# Altium project SmartHome.PrjPCB
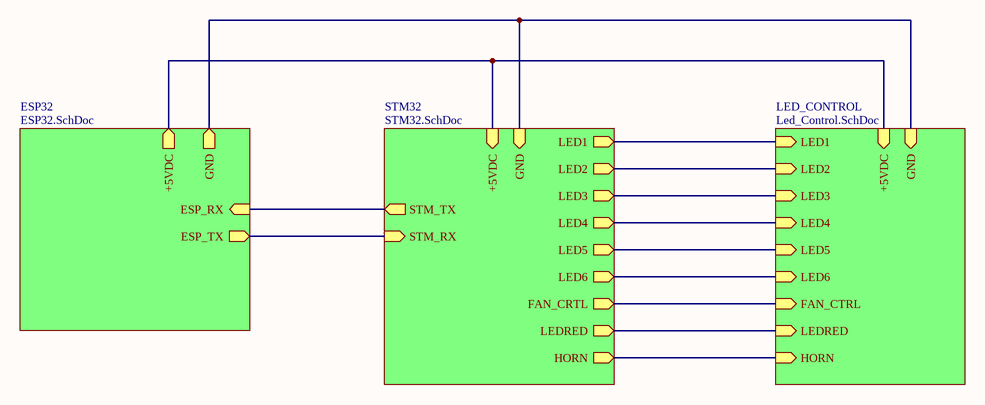
[diagram p0: Diagram.SchDoc]
4 sheets, 77 parts. Net scope: hierarchical (ports join the sheet entries above them; power ports are global).
Board file: SmartHome.PcbDoc
Sheets:
  Diagram.SchDoc
    STM32 = STM32.SchDoc
    ESP32 = ESP32.SchDoc
    LED_CONTROL = Led_Control.SchDoc

## Sheet Diagram.SchDoc
size A

### Sub-sheets
ESP32 = ESP32.SchDoc: ESP_RX (in), ESP_TX (out), GND (out), +5VDC (out)
LED_CONTROL = Led_Control.SchDoc: LED1 (in), LED2 (in), LED3 (in), LED4 (in), LED5 (in), LED6 (in), FAN_CTRL (in), LEDRED (in), HORN (in), GND (in), +5VDC (in)
STM32 = STM32.SchDoc: LED1 (out), LED2 (out), LED3 (out), LED4 (out), LED5 (out), LED6 (out), FAN_CRTL (out), LEDRED (out), HORN (out), STM_TX (out), STM_RX (in), +5VDC (in), GND (in)

### Nets
+5VDC: sheet STM32/+5VDC, sheet ESP32/+5VDC, sheet LED_CONTROL/+5VDC
GND: sheet STM32/GND, sheet ESP32/GND, sheet LED_CONTROL/GND
FAN_CTRL: sheet STM32/FAN_CRTL, sheet LED_CONTROL/FAN_CTRL
HORN: sheet STM32/HORN, sheet LED_CONTROL/HORN
LED1: sheet STM32/LED1, sheet LED_CONTROL/LED1
LED2: sheet STM32/LED2, sheet LED_CONTROL/LED2
LED3: sheet STM32/LED3, sheet LED_CONTROL/LED3
LED4: sheet STM32/LED4, sheet LED_CONTROL/LED4
LED5: sheet STM32/LED5, sheet LED_CONTROL/LED5
LED6: sheet STM32/LED6, sheet LED_CONTROL/LED6
LEDRED: sheet STM32/LEDRED, sheet LED_CONTROL/LEDRED
UART1_RX: sheet STM32/STM_RX, sheet ESP32/ESP_TX
UART1_TX: sheet STM32/STM_TX, sheet ESP32/ESP_RX

## Sheet STM32.SchDoc
size A3
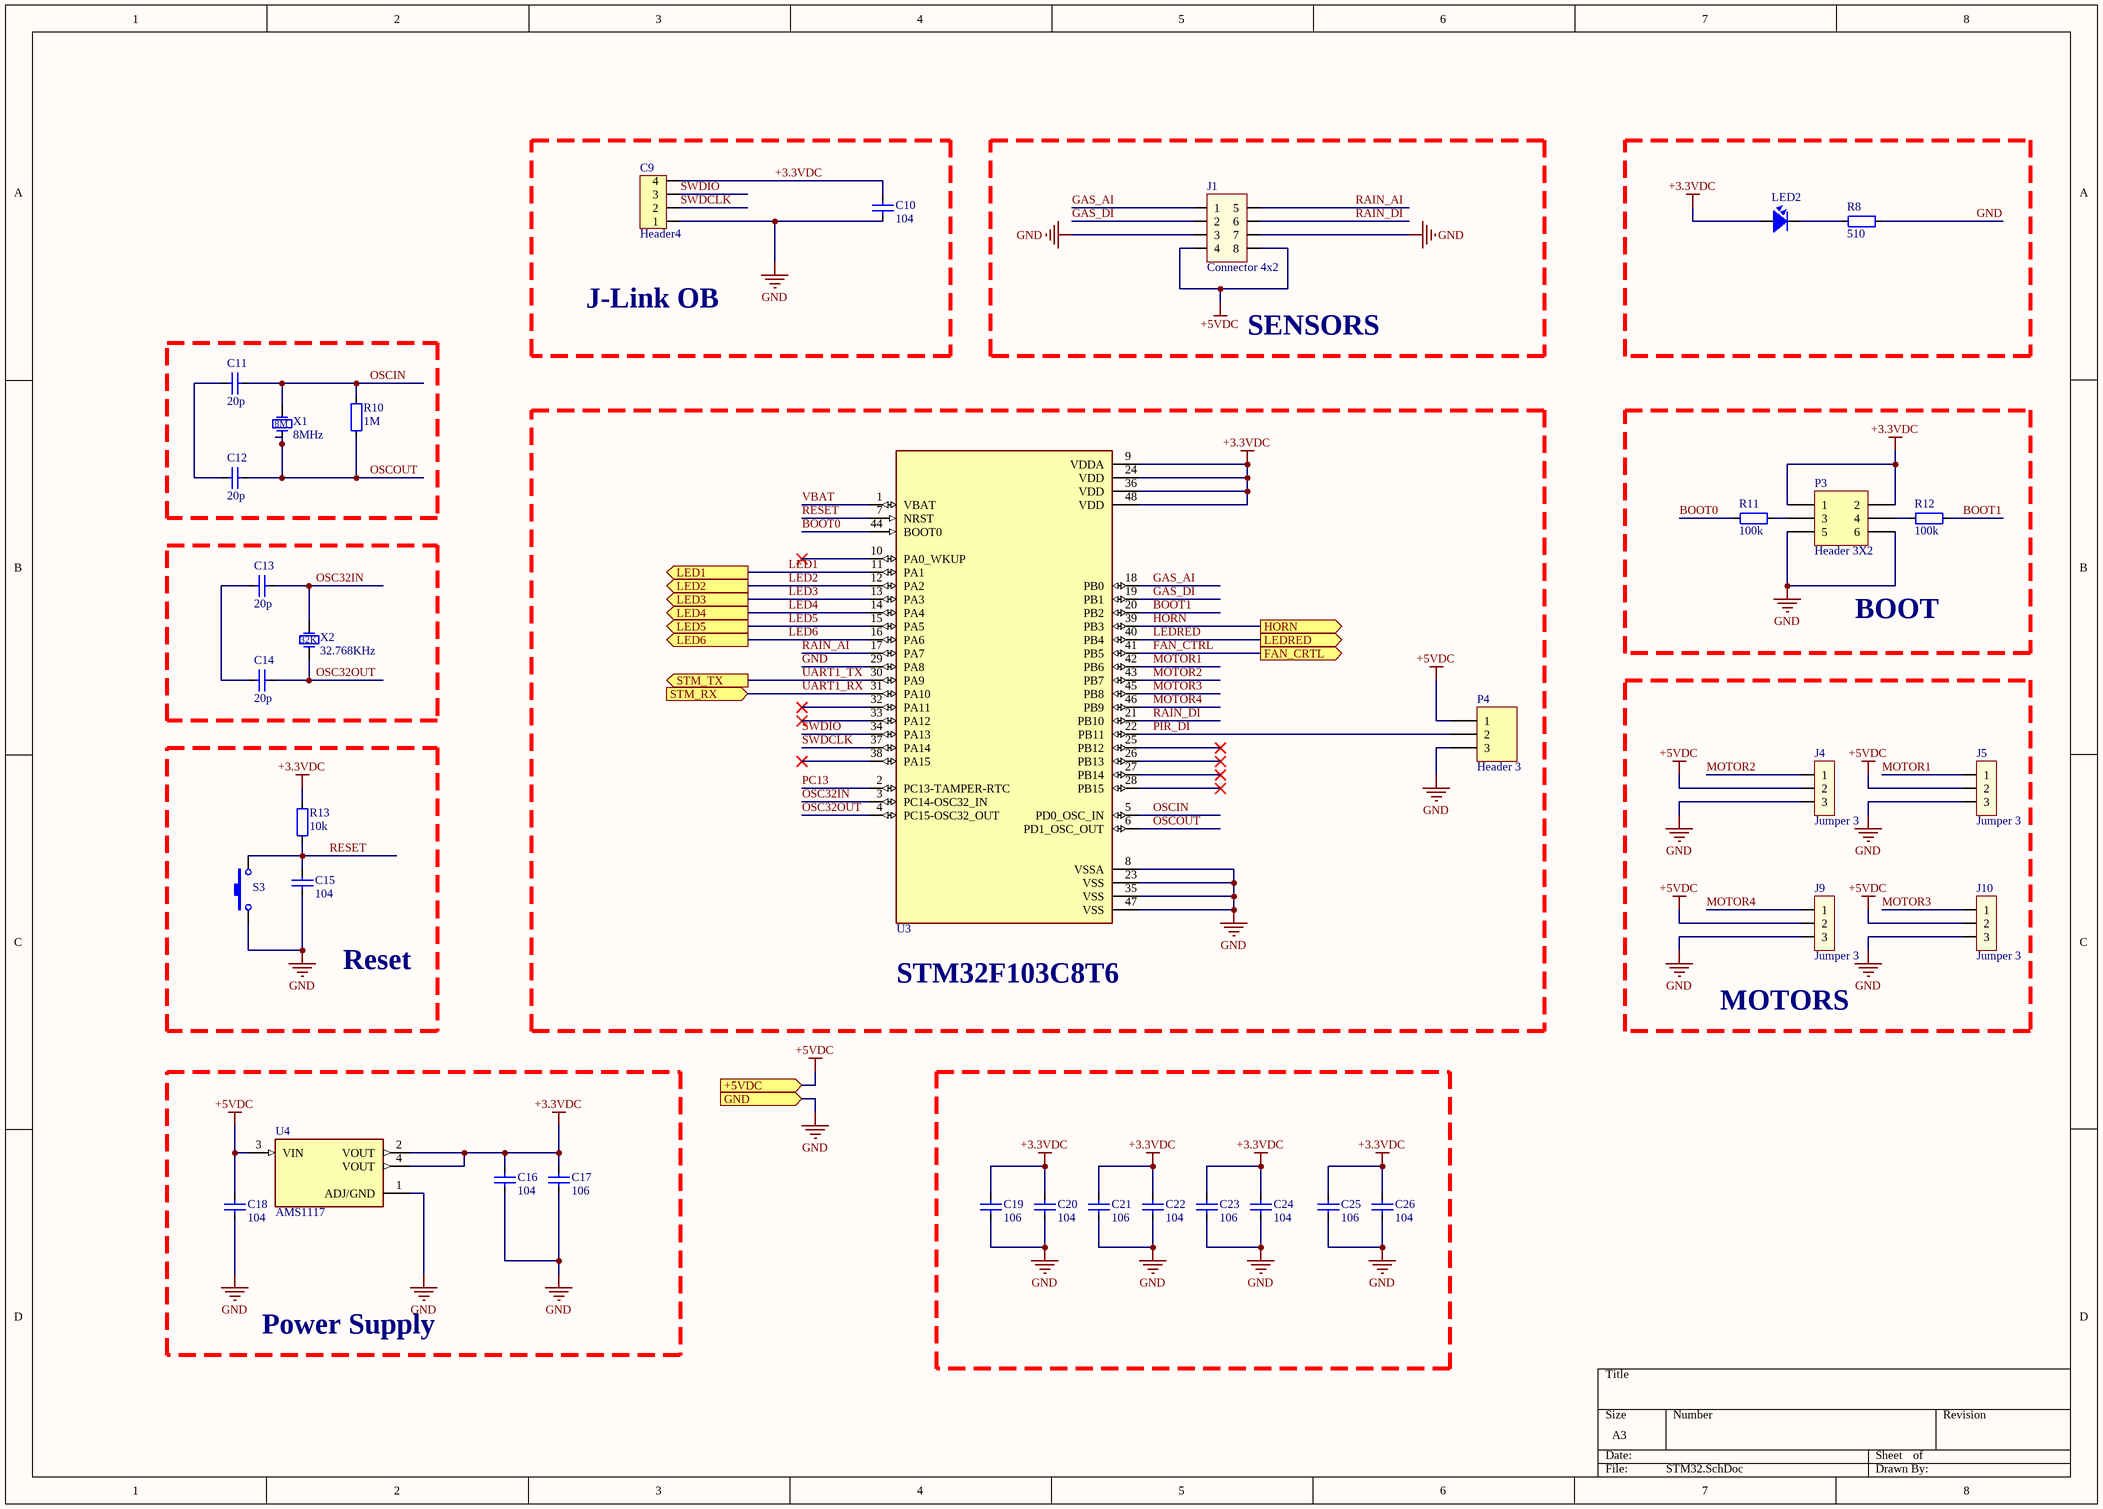
[diagram p1: STM32.SchDoc]

### Parts
C9  Header4  [Header4]
C10  104  [CAP_0805]
C11  20p  [CAP_0805]
C12  20p  [CAP_0805]
C13  20p  [CAP_0805]
C14  20p  [CAP_0805]
C15  104  [CAP_0805]
C16  104  [CAP_0805]
C17  106  [CAP_0805]
C18  104  [CAP_0805]
C19  106  [CAP_0805]
C20  104  [CAP_0805]
C21  106  [CAP_0805]
C22  104  [CAP_0805]
C23  106  [CAP_0805]
C24  104  [CAP_0805]
C25  106  [CAP_0805]
C26  104  [CAP_0805]
J1  Connector 4x2  [JP4x2]
J4  Jumper 3  [JP3]
J5  Jumper 3  [JP3]
J9  Jumper 3  [JP3]
J10  Jumper 3  [JP3]
LED2  LED  [LED-0805-Red]  (value not drawn)
P3  Header 3X2  [HDR2X3]
P4  Header 3  [HDR1X3]
R8  510  [RES-SMD-0805]
R10  1M  [RES-SMD-0805]
R11  100k  [RES-SMD-0805]
R12  100k  [RES-SMD-0805]
R13  10k  [RES-SMD-0805]
S3  SW-SMD  [SW-SMD]  (value not drawn)
U3  STM32  [LQFP 48]  (value not drawn)
U4  AMS1117  [SOT229P700X180-4N]
X1  8MHz  [CRYSTAL_ABM3 5x3.2mm]
X2  32.768KHz  [Crystal_ABS07_SMD-3.2x1.5MM]

### Blocks framed on the sheet
J-Link OB: C9 C10
SENSORS: J1
STM32F103C8T6: P4 U3
BOOT: P3 R11 R12
MOTORS: J4 J5 J9 J10
Reset: C15 R13 S3
Power Supply: C16-C18 U4

### Ports
+5VDC (in), FAN_CRTL (out), GND (in), HORN (out), LED1 (out), LED2 (out), LED3 (out), LED4 (out), LED5 (out), LED6 (out), LEDRED (out), STM_RX (in), STM_TX (out)

### Nets
+3.3VDC: C9.4 C10.2 C16.2 C17.2 C19.2 C20.2 C21.2 C22.2 C23.2 C24.2 C25.2 C26.2 LED2.1 P3.1 P3.2 R13.2 U3.9(VDDA) U3.24(VDD) U3.36(VDD) U3.48(VDD) U4.2(VOUT) U4.4(VOUT)
+5VDC: C18.2 J1.4 J1.8 J4.2 J5.2 J9.2 J10.2 P4.1 U4.3(VIN) ; port +5VDC
GND: C9.1 C10.1 C15.1 C16.1 C17.1 C18.1 C19.1 C20.1 C21.1 C22.1 C23.1 C24.1 C25.1 C26.1 J1.3 J1.7 J4.3 J5.3 J9.3 J10.3 P3.5 P3.6 P4.3 R8.1 S3.1 U3.8(VSSA) U3.23(VSS) U3.29(PA8) U3.35(VSS) U3.47(VSS) U4.1(ADJ/GND) ; port GND
BOOT0: R11.2 U3.44(BOOT0)
BOOT1: R12.1 U3.20(PB2)
FAN_CTRL: U3.41(PB5) ; port FAN_CRTL
GAS_AI: J1.1 U3.18(PB0)
GAS_DI: J1.2 U3.19(PB1)
HORN: U3.39(PB3) ; port HORN
LED1: U3.11(PA1) ; port LED1
LED2: U3.12(PA2) ; port LED2
LED3: U3.13(PA3) ; port LED3
LED4: U3.14(PA4) ; port LED4
LED5: U3.15(PA5) ; port LED5
LED6: U3.16(PA6) ; port LED6
LEDRED: U3.40(PB4) ; port LEDRED
MOTOR1: J5.1 U3.42(PB6)
MOTOR2: J4.1 U3.43(PB7)
MOTOR3: J10.1 U3.45(PB8)
MOTOR4: J9.1 U3.46(PB9)
OSC32IN: C13.1 U3.3(PC14-OSC32_IN) X2.1(OSC1)
OSC32OUT: C14.1 U3.4(PC15-OSC32_OUT) X2.2(OSC2)
OSCIN: C11.1 R10.2 U3.5(PD0_OSC_IN) X1.1(OSC1)
OSCOUT: C12.1 R10.1 U3.6(PD1_OSC_OUT) X1.2(OSC2)
PC13: U3.2(PC13-TAMPER-RTC)
PIR_DI: P4.2 U3.22(PB11)
RAIN_AI: J1.5 U3.17(PA7)
RAIN_DI: J1.6 U3.21(PB10)
RESET: C15.2 R13.1 S3.2 U3.7(NRST)
SWDCLK: C9.2 U3.37(PA14)
SWDIO: C9.3 U3.34(PA13)
UART1_RX: U3.31(PA10) ; port STM_RX
UART1_TX: U3.30(PA9) ; port STM_TX
VBAT: U3.1(VBAT)
NetC11_2: C11.2 C12.2
NetC13_2: C13.2 C14.2
NetLED2_2: LED2.2 R8.2
NetP3_3: P3.3 R11.1
NetP3_4: P3.4 R12.2

Not connected (* = marked no-connect by the designer): U3 10(PA0_WKUP)* 25(PB12)* 26(PB13)* 27(PB14)* 28(PB15)* 32(PA11)* 33(PA12)* 38(PA15)*

### Notes on the sheet
- (in symbol ABM3-8.000MHZ-D2Y-T) 8M
- (in symbol ABS07-32.768KHZ-T) 32K

### Library data of the parts
C9 = Header4: Header IDC, 4 x 1 Pin Vertical 2.54mm Pitch (Non-Boxed, Male); Manufacturer: W¨¹rth Elektronik eiSos GmbH; partNo: 613002143121; ComponentLink1 Description: Manufacturer; ComponentLink2 Description: Datasheet; NoPins: 02; Created Date: 29 March 2013; ComponentLink1URL: http://www.we-online.com; ComponentLink2URL: http://katalog.we-online.de/em/datasheet/6130xx143121.pdf; Created by: Karrer Zheng
C10-C26 = CapSMD: Capacitor; Value: 33p; Published: 8-Jun-2000; LatestRevisionDate: 17-Jul-2002; LatestRevisionNote: Re-released for DXP Platform.; PackageReference: RAD-0.3; Publisher: Altium Limited
J1 = JP4x2: Value: Connector 4x2
J4 J5 J9 J10 = JP3: Value: J3
LED2 = LED: LED Single colour Green and Red; Value: LED 3 ly Single Colour
P3 = Header 3X2: Header, 3-Pin, Dual row; LatestRevisionDate: 17-Jul-2002; LatestRevisionNote: Re-released for DXP Platform.; Publisher: Altium Limited
P4 = Header 3: Header, 3-Pin; LatestRevisionDate: 17-Jul-2002; LatestRevisionNote: Re-released for DXP Platform.; Publisher: Altium Limited
R8 R10-R13 = Resistor - SMD: Resistor; Manufacturer: Generic Components; Class: Passive; Published: 08/06/2000; Publisher: Altium Hobart Technology Centre
S3 = SW-SMD: Switch; Published: 24-Mar-1999; LatestRevisionDate: 17-Jul-2002; LatestRevisionNote: Re-released for DXP Platform.; PackageReference: SPST-2; Publisher: Altium Limited
U3 = STM32F103C8T6: STM32 ARM-based 32-bit MCU with 64 Kbytes Flash, 64-pin LQFP, Industrial Temperature
U4 = AMS1117: 1A LOW DROPOUT VOLTAGE REGULATOR SOT-223; MF: Advanced Monolithic Systems; Price: None; Availability: Not in stock; Package: SOT-223 Seeed Technology; MP: AMS1117; Value: *; SnapEDA_Link: https://www.snapeda.com/parts/AMS1117/Advanced+Monolithic+Systems/view-part/?ref=snap; Check_prices: https://www.snapeda.com/parts/AMS1117/Advanced+Monolithic+Systems/view-part/?ref=eda
X1 = ABM3-8.000MHZ-D2Y-T: CRYSTAL 8.0000MHZ 18pF SMD; Solder: SMT; CompanyID: VT-00517; Value: 8MHz; MPN: ABM3-8.000MHZ-D2Y-T; Category: CRYSTAL
X2 = ABS07-32.768KHZ-T: CRYSTAL 32.7680KHZ 12.5pF SMD; Solder: SMT; CompanyID: VT-01153; MPN: ABS07-32.768KHZ-T; Value: 32.768KHz; Category: CRYSTAL

## Sheet ESP32.SchDoc
size A4
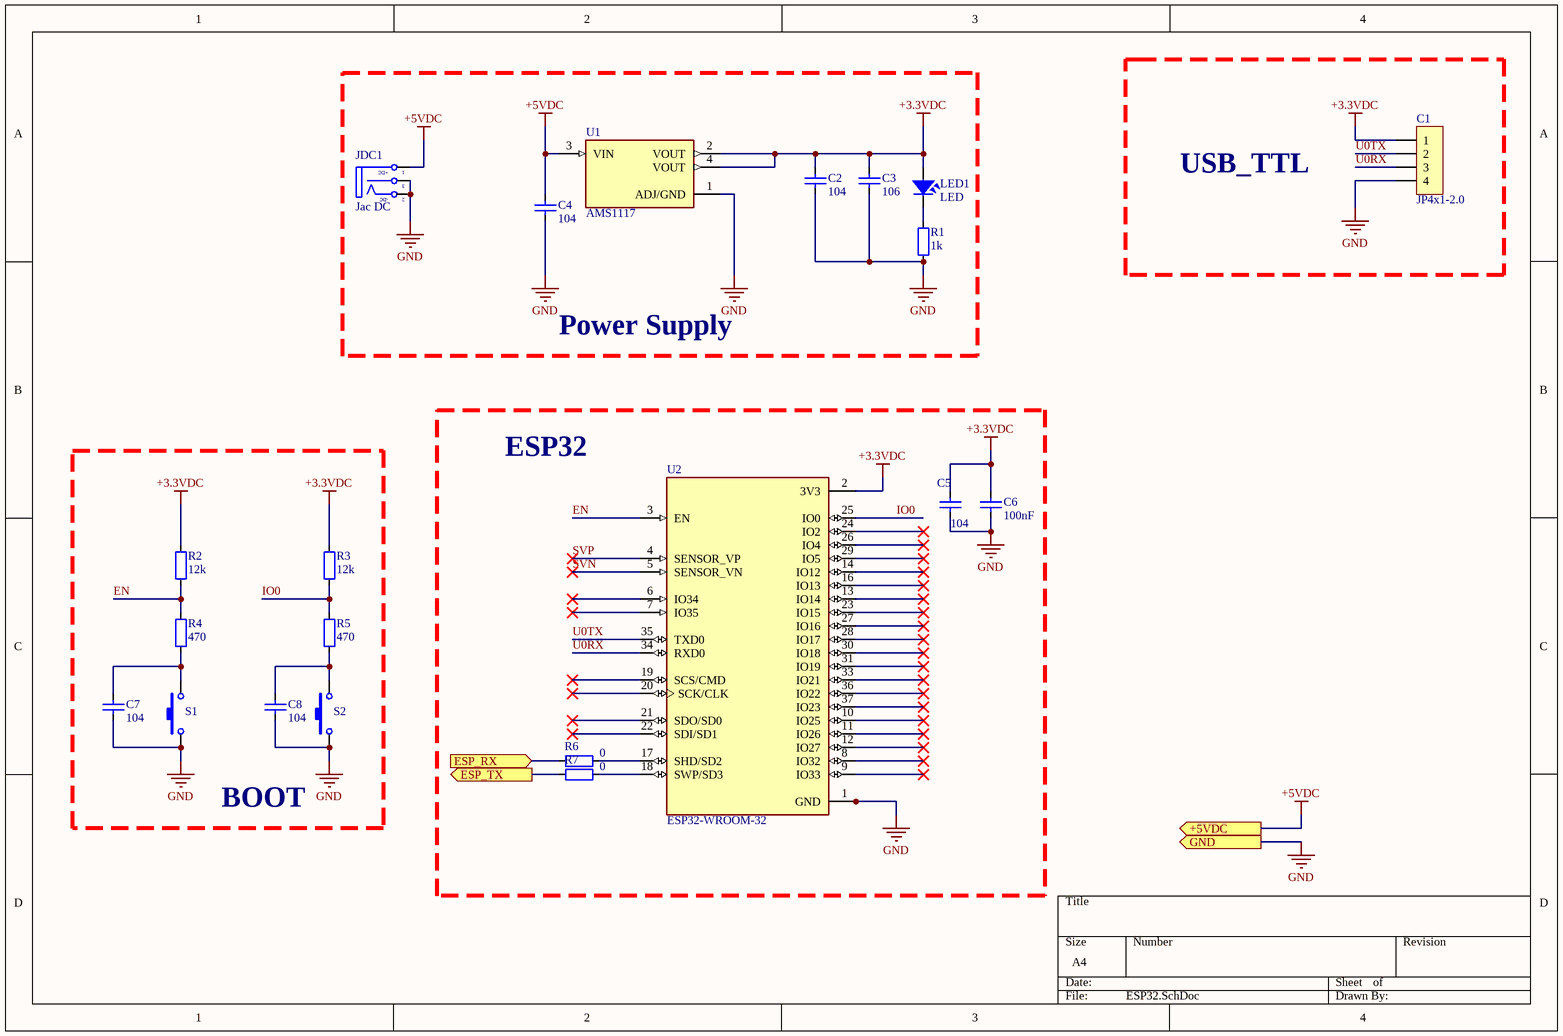
[diagram p2: ESP32.SchDoc]

### Parts
C1  JP4x1-2.0  [J4-D1T]
C2  104  [CAP_0805]
C3  106  [CAP_0805]
C4  104  [CAP_0805]
C5  104  [CAP_0805]
C6  100nF  [CAP_0805]
C7  104  [CAP_0805]
C8  104  [CAP_0805]
JDC1  Jac DC  [DC-IN]
LED1  LED  [LED-0805-Red]
R1  1k  [RES-SMD-0805]
R2  12k  [RES-SMD-0805]
R3  12k  [RES-SMD-0805]
R4  470  [RES-SMD-0805]
R5  470  [RES-SMD-0805]
R6  0  [RES-SMD-0805]
R7  0  [RES-SMD-0805]
S1  SW-SMD  [SW-SMD]  (value not drawn)
S2  SW-SMD  [SW-SMD]  (value not drawn)
U1  AMS1117  [SOT229P700X180-4N]
U2  ESP32-WROOM-32  [MODULE_ESP32-WROOM-32]

### Blocks framed on the sheet
Power Supply: C2-C4 JDC1 LED1 R1 U1
USB_TTL: C1
ESP32: C5 C6 R6 R7 U2
BOOT: C7 C8 R2-R5 S1 S2

### Ports
+5VDC (out), ESP_RX (in), ESP_TX (out), GND (out)

### Nets
+3.3VDC: C1.1 C2.2 C3.2 C5.2 C6.2 LED1.1 R2.1 R3.1 U1.2(VOUT) U1.4(VOUT) U2.2(3V3)
+5VDC: C4.2 JDC1.1(T) U1.3(VIN) ; port +5VDC
GND: C1.4 C2.1 C3.1 C4.1 C5.1 C6.1 C7.1 C8.1 JDC1.2(TN) JDC1.3(S) R1.1 S1.1 S2.1 U1.1(ADJ/GND) U2.1(GND) U2.15(GND) U2.38(GND) U2.39_1(GND) U2.39_2(GND) U2.39_3(GND) U2.39_4(GND) U2.39_5(GND) U2.39_6(GND) U2.39_7(GND) U2.39_8(GND) U2.39_9(GND) U2.39_10(GND) U2.39_11(GND) U2.39_12(GND) U2.39_13(GND) U2.39_14(GND) U2.39_15(GND) U2.39_16(GND) U2.39_17(GND) U2.39_18(GND) U2.39_19(GND) U2.39_20(GND) U2.39_21(GND) ; port GND
EN: R2.2 R4.1 U2.3(EN)
IO0: R3.2 R5.1 U2.25(IO0)
SVN: U2.5(SENSOR_VN)
SVP: U2.4(SENSOR_VP)
U0RX: C1.3 U2.34(RXD0)
U0TX: C1.2 U2.35(TXD0)
UART1_RX: R7.1 ; port ESP_TX
UART1_TX: R6.1 ; port ESP_RX
NetC7_2: C7.2 R4.2 S1.2
NetC8_2: C8.2 R5.2 S2.2
NetLED1_2: LED1.2 R1.2
NetR6_2: R6.2 U2.17(SHD/SD2)
NetR7_2: R7.2 U2.18(SWP/SD3)

Not connected (* = marked no-connect by the designer): U2 6(IO34)* 7(IO35)* 8(IO32)* 9(IO33)* 10(IO25)* 11(IO26)* 12(IO27)* 13(IO14)* 14(IO12)* 16(IO13)* 19(SCS/CMD)* 20(SCK/CLK)* 21(SDO/SD0)* 22(SDI/SD1)* 23(IO15)* 24(IO2)* 26(IO4)* 27(IO16)* 28(IO17)* 29(IO5)* 30(IO18)* 31(IO19)* 33(IO21)* 36(IO22)* 37(IO23)*

### Notes on the sheet
- (in symbol DCIN) +DC; -DC

### Library data of the parts
C1 = JP4x1-2.0: WR-PHD 2.00 mm Socket Header; Manufacturer: W¨¹rth Elektronik eiSos GmbH; partNo: 62000411821; ComponentLink1 Description: Manufacturer; ComponentLink2 Description: Datasheet; NoPins: 04; Created Date: 2 April 2013; ComponentLink1URL: http://www.we-online.com; ComponentLink2URL: http://katalog.we-online.de/em/datasheet/6200xx11821.pdf; Created by: Karrer Zheng
C2-C8 = CapSMD: Capacitor; Value: 33p; Published: 8-Jun-2000; LatestRevisionDate: 17-Jul-2002; LatestRevisionNote: Re-released for DXP Platform.; PackageReference: RAD-0.3; Publisher: Altium Limited
JDC1 = DCIN: Jac DC input; Value: Jac DC
LED1 = LED: as LED2 on sheet STM32
R1-R7 = Resistor - SMD: as R8 on sheet STM32; Published: 08/06/2000; Publisher: Altium Hobart Technology Centre
S1 S2 = SW-SMD: Switch; Published: 24-Mar-1999; LatestRevisionDate: 17-Jul-2002; LatestRevisionNote: Re-released for DXP Platform.; PackageReference: SPST-2; Publisher: Altium Limited
U1 = AMS1117: as U4 on sheet STM32; Price: None; Availability: Not in stock; Package: SOT-223 Seeed Technology; MP: AMS1117; Value: *; SnapEDA_Link: https://www.snapeda.com/parts/AMS1117/Advanced+Monolithic+Systems/view-part/?ref=snap; Check_prices: https://www.snapeda.com/parts/AMS1117/Advanced+Monolithic+Systems/view-part/?ref=eda
U2 = ESP32-WROOM-32: Bluetooth, WiFi Transceiver Module 2.4GHz ~ 2.5GHz Surface Mount; MF: Espressif Systems; Package: Module Espressif Systems; Digi-Key_Part_Number: 1904-1010-1-ND; Digi-Key_Purchase_URL: https://www.digikey.com/product-detail/en/espressif-systems/ESP32-WROOM-32/1904-1010-1-ND/8544305?utm_source=snapeda&utm_medium=aggregator&utm_campaign=symbol; Value: *; MP: ESP32-WROOM-32; SnapEDA_Link: https://www.snapeda.com/parts/ESP32-WROOM-32/Espressif%20Systems/view-part/2753322/?ref=snap

## Sheet Led_Control.SchDoc
size A
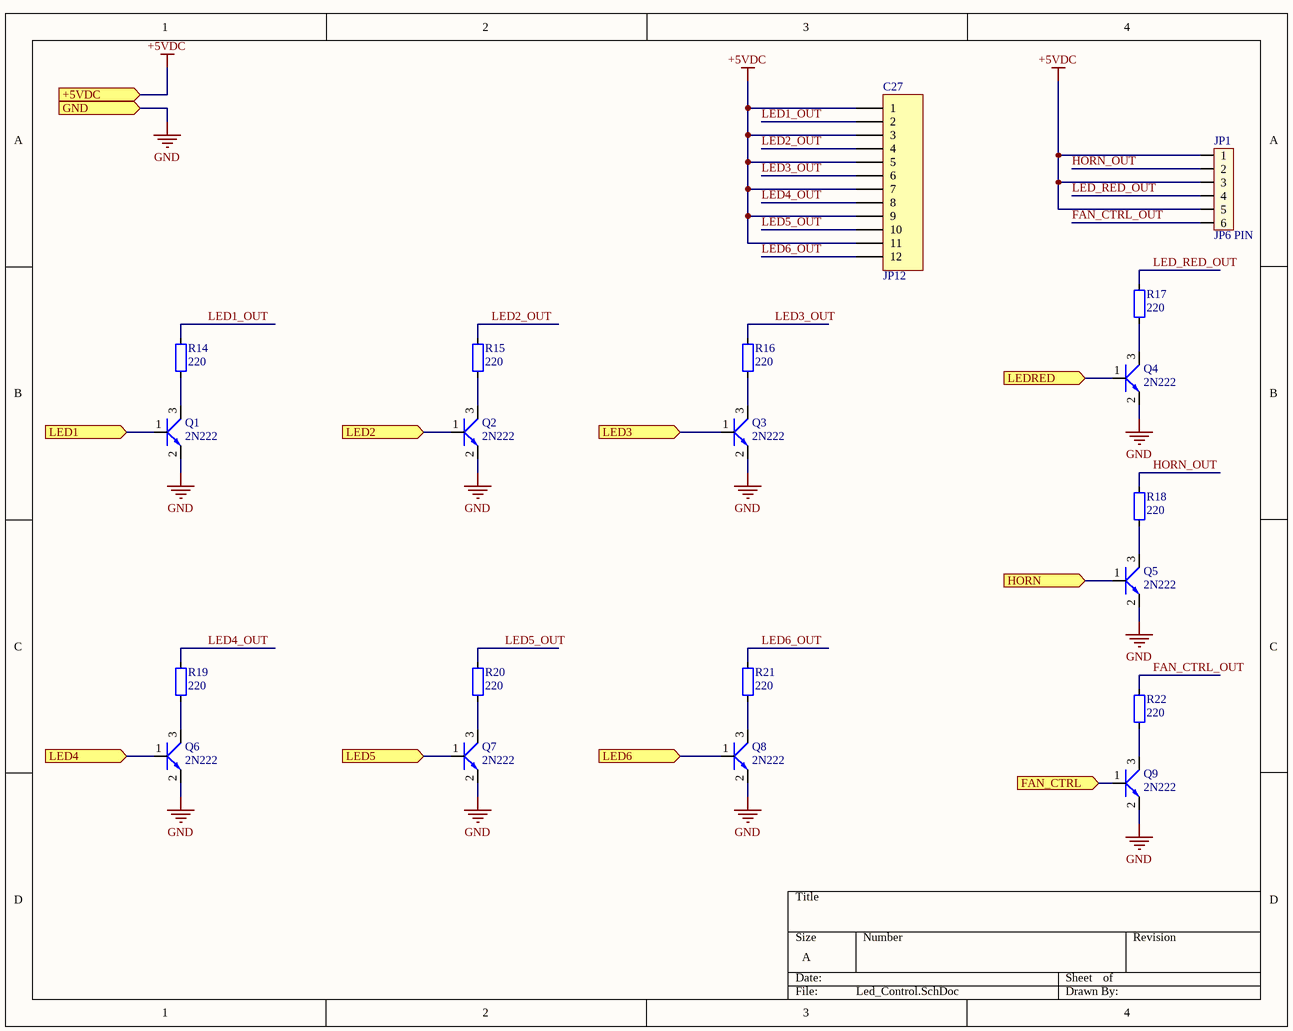
[diagram p3: Led_Control.SchDoc]

### Parts
C27  JP12  [JP12-D1T]
JP1  JP6 PIN  [JP6]
Q1  2N222  [SOT23D]
Q2  2N222  [SOT23D]
Q3  2N222  [SOT23D]
Q4  2N222  [SOT23D]
Q5  2N222  [SOT23D]
Q6  2N222  [SOT23D]
Q7  2N222  [SOT23D]
Q8  2N222  [SOT23D]
Q9  2N222  [SOT23D]
R14  220  [RES-SMD-0805]
R15  220  [RES-SMD-0805]
R16  220  [RES-SMD-0805]
R17  220  [RES-SMD-0805]
R18  220  [RES-SMD-0805]
R19  220  [RES-SMD-0805]
R20  220  [RES-SMD-0805]
R21  220  [RES-SMD-0805]
R22  220  [RES-SMD-0805]

### Ports
+5VDC (in), FAN_CTRL (in), GND (in), HORN (in), LED1 (in), LED2 (in), LED3 (in), LED4 (in), LED5 (in), LED6 (in), LEDRED (in)

### Nets
+5VDC: C27.1 C27.3 C27.5 C27.7 C27.9 C27.11 JP1.1 JP1.3 JP1.5 ; port +5VDC
GND: Q1.2(E) Q2.2(E) Q3.2(E) Q4.2(E) Q5.2(E) Q6.2(E) Q7.2(E) Q8.2(E) Q9.2(E) ; port GND
FAN_CTRL: Q9.1(B) ; port FAN_CTRL
FAN_CTRL_OUT: JP1.6 R22.2
HORN: Q5.1(B) ; port HORN
HORN_OUT: JP1.2 R18.2
LED1: Q1.1(B) ; port LED1
LED1_OUT: C27.2 R14.2
LED2: Q2.1(B) ; port LED2
LED2_OUT: C27.4 R15.2
LED3: Q3.1(B) ; port LED3
LED3_OUT: C27.6 R16.2
LED4: Q6.1(B) ; port LED4
LED4_OUT: C27.8 R19.2
LED5: Q7.1(B) ; port LED5
LED5_OUT: C27.10 R20.2
LED6: Q8.1(B) ; port LED6
LED6_OUT: C27.12 R21.2
LED_RED_OUT: JP1.4 R17.2
LEDRED: Q4.1(B) ; port LEDRED
NetQ1_3: Q1.3(C) R14.1
NetQ2_3: Q2.3(C) R15.1
NetQ3_3: Q3.3(C) R16.1
NetQ4_3: Q4.3(C) R17.1
NetQ5_3: Q5.3(C) R18.1
NetQ6_3: Q6.3(C) R19.1
NetQ7_3: Q7.3(C) R20.1
NetQ8_3: Q8.3(C) R21.1
NetQ9_3: Q9.3(C) R22.1

### Library data of the parts
C27 = JP12: WR-PHD 2.54 mm Angled Socket Header; Manufacturer: W¨¹rth Elektronik eiSos GmbH; partNo: 613012143121; ComponentLink1 Description: Manufacturer; ComponentLink2 Description: Datasheet; NoPins: 12; Created Date: 29 March 2013; ComponentLink1URL: http://www.we-online.com; ComponentLink2URL: http://katalog.we-online.de/em/datasheet/6130xx143121.pdf; Created by: Karrer Zheng
JP1 = JP6: Value: JP7
Q1-Q9 = 2N222: NPN 600mW, ECB; Value: C1815
R14-R22 = Resistor - SMD: as R8 on sheet STM32; Published: 08/06/2000; Publisher: Altium Hobart Technology Centre

## Nets that join several sheets
+3.3VDC: STM32 (22 pins), ESP32 (11 pins)
+5VDC: STM32 (9 pins), ESP32 (C4.2 JDC1.1 U1.3), Led_Control (9 pins)
GND: STM32 (31 pins), ESP32 (38 pins), Led_Control (9 pins)
FAN_CTRL: STM32 (U3.41), Led_Control (Q9.1)
HORN: STM32 (U3.39), Led_Control (Q5.1)
LED1: STM32 (U3.11), Led_Control (Q1.1)
LED2: STM32 (U3.12), Led_Control (Q2.1)
LED3: STM32 (U3.13), Led_Control (Q3.1)
LED4: STM32 (U3.14), Led_Control (Q6.1)
LED5: STM32 (U3.15), Led_Control (Q7.1)
LED6: STM32 (U3.16), Led_Control (Q8.1)
LEDRED: STM32 (U3.40), Led_Control (Q4.1)
UART1_RX: STM32 (U3.31), ESP32 (R7.1)
UART1_TX: STM32 (U3.30), ESP32 (R6.1)